# Altium schematic sheet PwrSup.SchDoc
size A
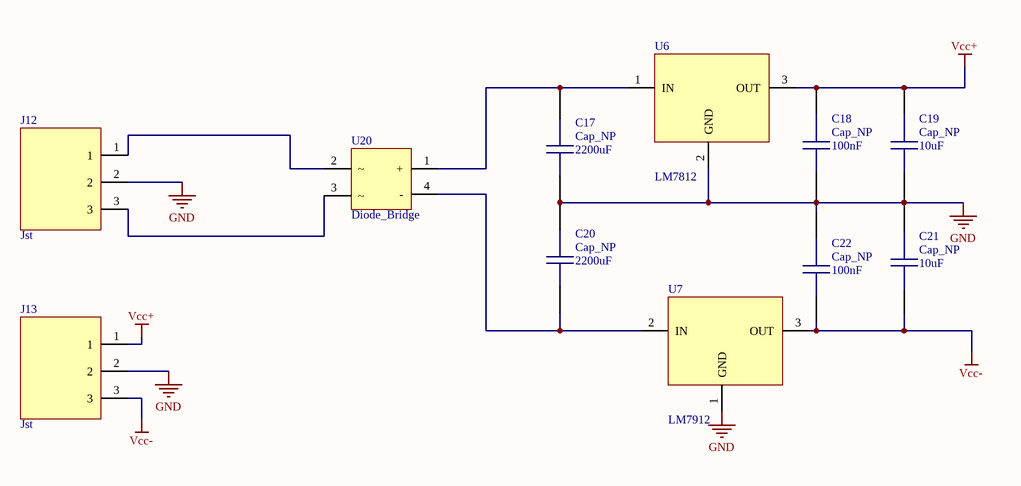
[diagram p0: PwrSup.SchDoc]

## Parts
C17  Cap_NP  value 2200uF  [Cap NP]
C18  Cap_NP  value 100nF  [Cap NP]
C19  Cap_NP  value 10uF  [Cap NP]
C20  Cap_NP  value 2200uF  [Cap NP]
C21  Cap_NP  value 10uF  [Cap NP]
C22  Cap_NP  value 100nF  [Cap NP]
J12  Jst  [Jst_3p]
J13  Jst  [Jst_3p]
U6  LM7812  [TIP 31]
U7  LM7912  [TIP 31]
U20  Diode_Bridge  [Diode Bridge 2]

## Nets
GND: C17.1 C18.1 C19.1 C20.2 C21.2 C22.2 J12.2 J13.2 U6.2(GND) U7.1(GND)
Vcc+: C18.2 C19.2 J13.1 U6.3(OUT)
Vcc-: C21.1 C22.1 J13.3 U7.3(OUT)
NetC17_2: C17.2 U6.1(IN) U20.1(+)
NetC20_1: C20.1 U7.2(IN) U20.4(-)
NetJ12_1: J12.1 U20.2
NetJ12_3: J12.3 U20.3

## Library data of the parts
J12 J13 = Jst_3p